# EAGLE schematic passive volume control (EAGLE 6.2)
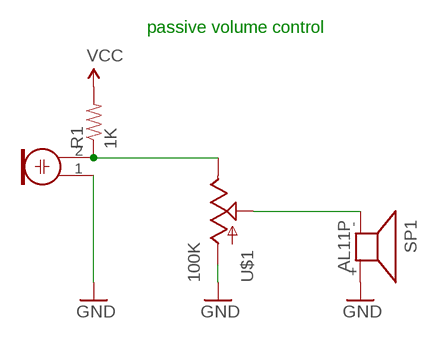
[diagram p0: schematic, sheet 1]

## Parts
M1  ELECTRET_MICROPHON-F6035AP  [F6035AP]
R1  1K  RESISTORAXIAL-0.3  [AXIAL-0.3]
SP1  AL11P  [AL11P]
U$1  100K  POT  [ALPS_POT]

## Nets
GND: M1.1 SP1.+ U$1.P$3(A)
N$1: M1.2 R1.P$1 U$1.P$1(E)
N$2: SP1.- U$1.P$2(S)
VCC: R1.P$2

## Notes on the sheet
- passive volume control

## Library data of the parts
M1 = microphon:ELECTRET_MICROPHON-: Electret Condenser Microphone
R1 = SparkFun-Passives:RESISTOR: Resistor Basic schematic elements and footprints for 0603, 1206, and PTH resistors.
SP1 = buzzer:AL11P: SPEAKER Source: Buerklin; OC_FARNELL: unknown; OC_NEWARK: unknown
U$1 = SparkFun-Electromechanical:POT